# EAGLE design adapter (EAGLE 6.6.0)
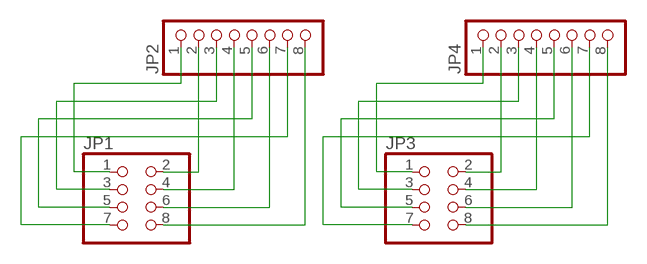
[diagram p0: schematic, sheet 1]

## Parts
JP1  PINHD-2X4  [2X04]
JP2  PINHD-1X8SMD_SMALL  [1X08/SMD_SMALL]
JP3  PINHD-2X4  [2X04]
JP4  PINHD-1X8SMD_SMALL  [1X08/SMD_SMALL]

## Nets
N$1: JP1.1 JP2.1
N$2: JP1.2 JP2.2
N$3: JP1.3 JP2.3
N$4: JP1.4 JP2.4
N$5: JP1.5 JP2.5
N$6: JP1.6 JP2.6
N$7: JP1.7 JP2.7
N$8: JP1.8 JP2.8
N$9: JP3.1 JP4.1
N$10: JP3.2 JP4.2
N$11: JP3.3 JP4.3
N$12: JP3.4 JP4.4
N$13: JP3.5 JP4.5
N$14: JP3.6 JP4.6
N$15: JP3.7 JP4.7
N$16: JP3.8 JP4.8

## Library data of the parts
JP1 JP3 = pinhead:PINHD-2X4: PIN HEADER
JP2 JP4 = smd_pinhead:PINHD-1X8: PIN HEADER

## Board
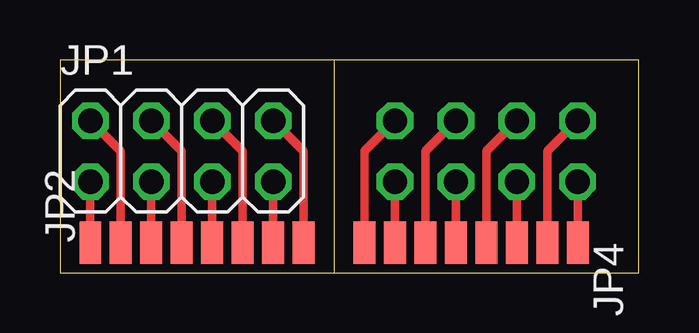
[diagram p1: board, top side]
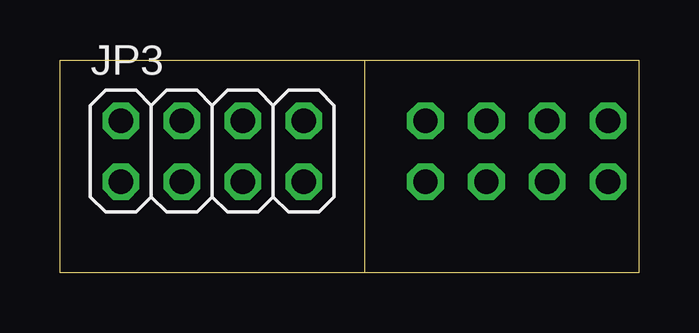
[diagram p2: board, bottom side, seen from below]

Size 24.13 x 8.89 mm. Coordinates in mm from the lower left corner, seen from the top.
Outline: 11.43,0 0,0 0,8.89 11.43,8.89
Outline: 11.43,0 24.13,0 24.13,8.89 11.43,8.89
Outline: 11.43,8.89 11.43,0
Copper layers (1*16): Top 0.035mm / dielectric 1.5mm / Bottom 0.035mm
Design rules "default *": minimum track width 10mil, minimum drill 24mil, track to track 8mil, track to pad 8mil, pad to pad 8mil, via to via 8mil, smd to smd 8mil, copper to edge 0mil, drill to drill 8mil, minimum pad ring 10mil, minimum via ring 8mil, stop-mask expansion 4mil, vias tented up to drill 0mil, thermal gap 10mil

### Footprints (pad centres in the part's own frame; a part is rotated, then mirrored left to right if it is on the bottom)
2X04 = drill 1.016 octagon: 1 -3.81,-1.27; 2 -3.81,1.27; 3 -1.27,-1.27; 4 -1.27,1.27; 5 1.27,-1.27; 6 1.27,1.27; 7 3.81,-1.27; 8 3.81,1.27
1X08/SMD_SMALL = smd 0.914 x 1.778: 1 -4.445,0; 2 -3.175,0; 3 -1.905,0; 4 -0.635,0; 5 0.635,0; 6 1.905,0; 7 3.175,0; 8 4.445,0

### Placement (x,y rotation side)
JP1  5.08,5.08 0 top
JP2  5.71,1.27 0 top
JP3  17.78,5.08 0 bottom
JP4  17.14,1.27 180 top

### Tracks (layer width: path | path; a pad name or v marks a point on that pad's centre or on a via)
N$1
  Top 0.356: JP1.1 JP2.1
N$2
  Top 0.356: JP1.2 2.54,5.08 JP2.2
N$3
  Top 0.356: JP1.3 JP2.3
N$4
  Top 0.356: JP1.4 5.08,5.08 JP2.4
N$5
  Top 0.356: JP1.5 JP2.5
N$6
  Top 0.356: JP1.6 7.62,5.08 JP2.6
N$7
  Top 0.356: JP1.7 JP2.7
N$8
  Top 0.356: JP1.8 10.16,5.08 JP2.8
N$9
  Top 0.356: JP3.1 JP4.1
N$10
  Top 0.356: JP3.2 20.32,5.08 JP4.2
N$11
  Top 0.356: JP3.3 JP4.3
N$12
  Top 0.356: JP3.4 17.78,5.08 JP4.4
N$13
  Top 0.356: JP3.5 JP4.5
N$14
  Top 0.356: JP3.6 15.24,5.08 JP4.6
N$15
  Top 0.356: JP3.7 JP4.7
N$16
  Top 0.356: JP3.8 12.7,5.08 JP4.8